# Altium schematic sheet electrRoom.SchDoc
size A4; SheetNumber: 3; SheetTotal: 3; SPICEModelCacheEMVUKTHD: <root> / <DocumentId>EMVUKTHD</DocumentId> / <CacheFrame Number="0"> / <Model Name="nmos" Kind="MDL"> / <Text>*Default N-Channel MOSFET / *Pinout: D,G,S / .MODEL NMOS NMOS()</Text> / </Model> / </CacheFrame> / </root>
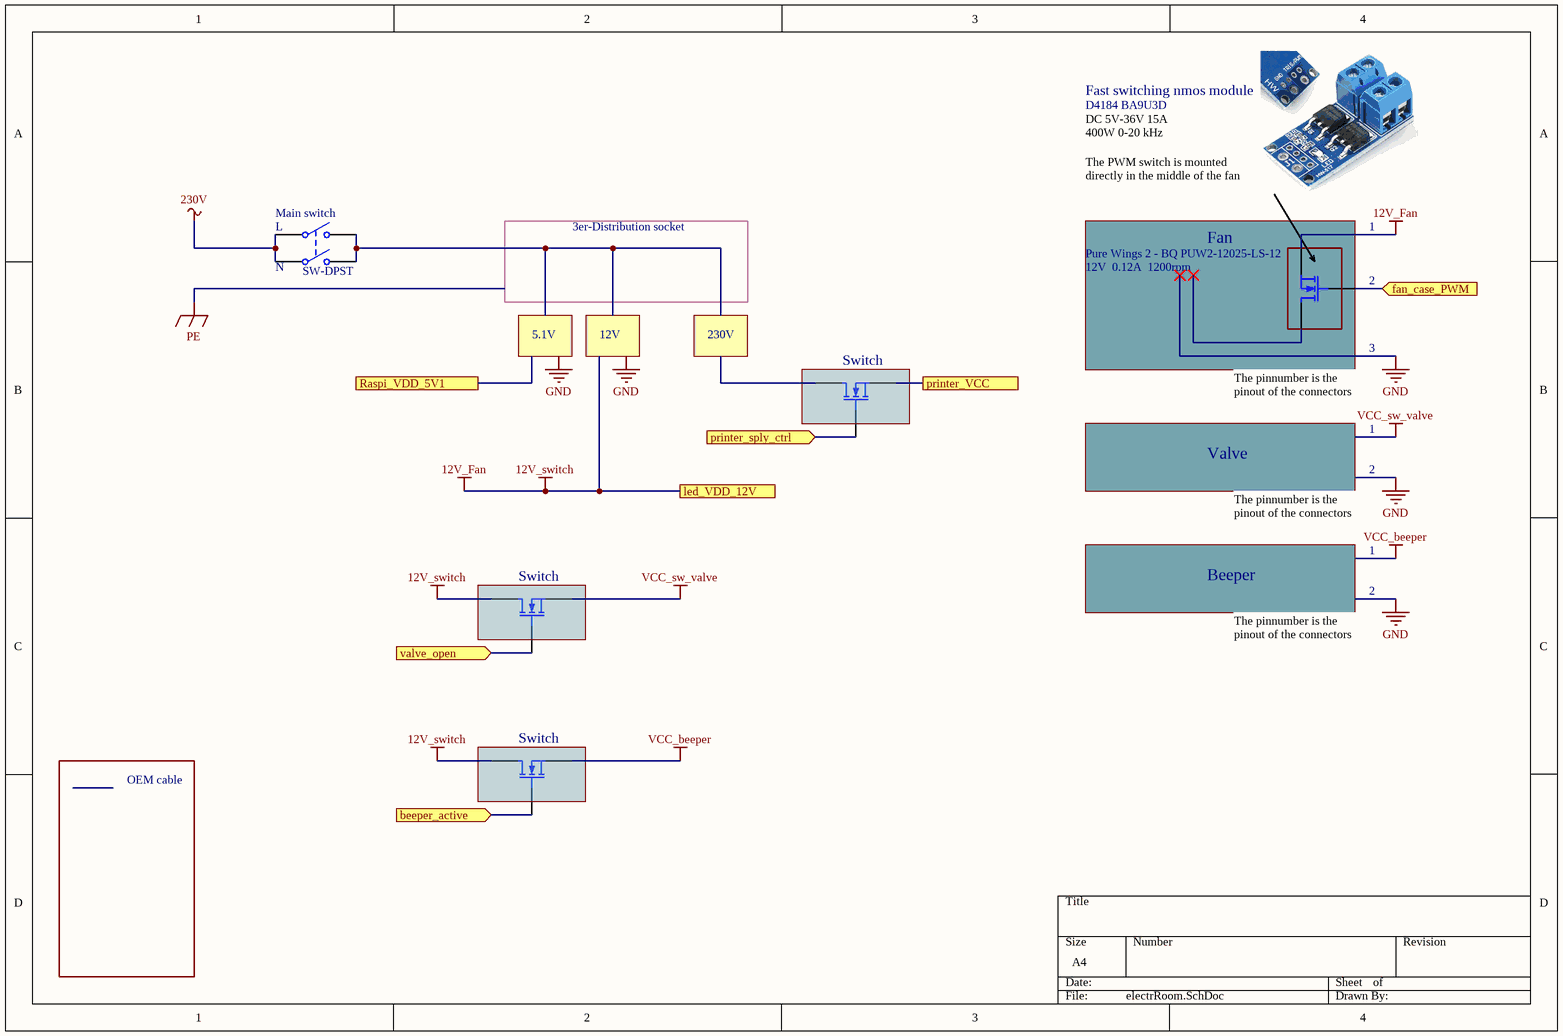
[diagram p0: electrRoom.SchDoc]

## Parts
(Parts that share a designator on the sheet are numbered #1, #2 ... from top to bottom, then left to right.)
Main_switch  SW-DPST  [DPST-4]
Q?#1  MOSFET-N  [E3]  (value not drawn)
Q?#2  MOSFET-N  [E3]  (value not drawn)
Q?#3  MOSFET-N  [E3]  (value not drawn)
Q?#4  MOSFET-N  [E3]  (value not drawn)

## Blocks framed on the sheet
Fan: Q?#1
Switch: Q?#2
Switch: Q?#3
Switch: Q?#4

## Ports
beeper_active (in), fan_case_PWM (in), led_VDD_12V, printer_sply_ctrl (in), printer_VCC, Raspi_VDD_5V1, valve_open (in)

## Nets
12V_Fan: Q?#1.3(S) Q?#3.1(D) Q?#4.1(D) ; port led_VDD_12V  [also labelled 12V_switch]
230V: Main_switch.1(COMMON1) Main_switch.3(COMMON2)
VCC_beeper: Q?#4.3(S)
VCC_sw_valve: Q?#3.3(S)
beeper_active: Q?#4.2(G) ; port beeper_active
fan_case_PWM: Q?#1.2(G) ; port fan_case_PWM
printer_sply_ctrl: Q?#2.2(G) ; port printer_sply_ctrl
valve_open: Q?#3.2(G) ; port valve_open
NetMain_switch_2: Main_switch.2(NO1) Main_switch.4(NO2)

Not connected (* = marked no-connect by the designer): Q?#1 1(D)*; Q?#2 1(D) 3(S)

## Notes on the sheet
- Fast switching nmos module
- D4184 BA9U3D
- DC 5V-36V 15A
- 400W 0-20 kHz
- The PWM switch is mounted directly in the middle of the fan
- (near Main_switch) L
- 3er-Distribution socket
- 1
- (near Main_switch) N
- (near Q?#1) Pure Wings 2 - BQ PUW2-12025-LS-12
- 12V  0.12A  1200rpm
- (near Q?#1) 2
- 5.1V
- 12V
- 230V
- 3
- The pinnumber is the pinout of the connectors
- Valve
- 2
- Beeper
- OEM cable
- Labels drawn without touching a wire or pin: GND

## Library data of the parts
Main_switch = SW-DPST: Double-Pole, Single-Throw Switch; Published: 24-Mar-1999; LatestRevisionDate: 17-Jul-2002; LatestRevisionNote: Re-released for DXP Platform.; PackageReference: DPST-4; Publisher: Altium Limited; PackageDescription: Switch; 4 Leads
Q?#1-Q?#4 = MOSFET-N: N-Channel MOSFET; Published: 8-Jun-2000; LatestRevisionDate: 17-Jul-2002; LatestRevisionNote: Re-released for DXP Platform.; PackageVersion: 1995/1996; PackageReference: E3; Publisher: Altium Limited; PackageDescription: TO, Flat Index; 3 In-Line, Axial Leads; Body Dia. 4.6mm; Lead Dia. 0.5 mm (max)